# Altium schematic sheet HCPL-3120 DIP Gate Driver Circuit.SchDoc
size A0; SheetNumber: 1; SheetTotal: 1; SPICEModelCacheYLEDQIFW: <root> / <DocumentId>YLEDQIFW</DocumentId> / </root>
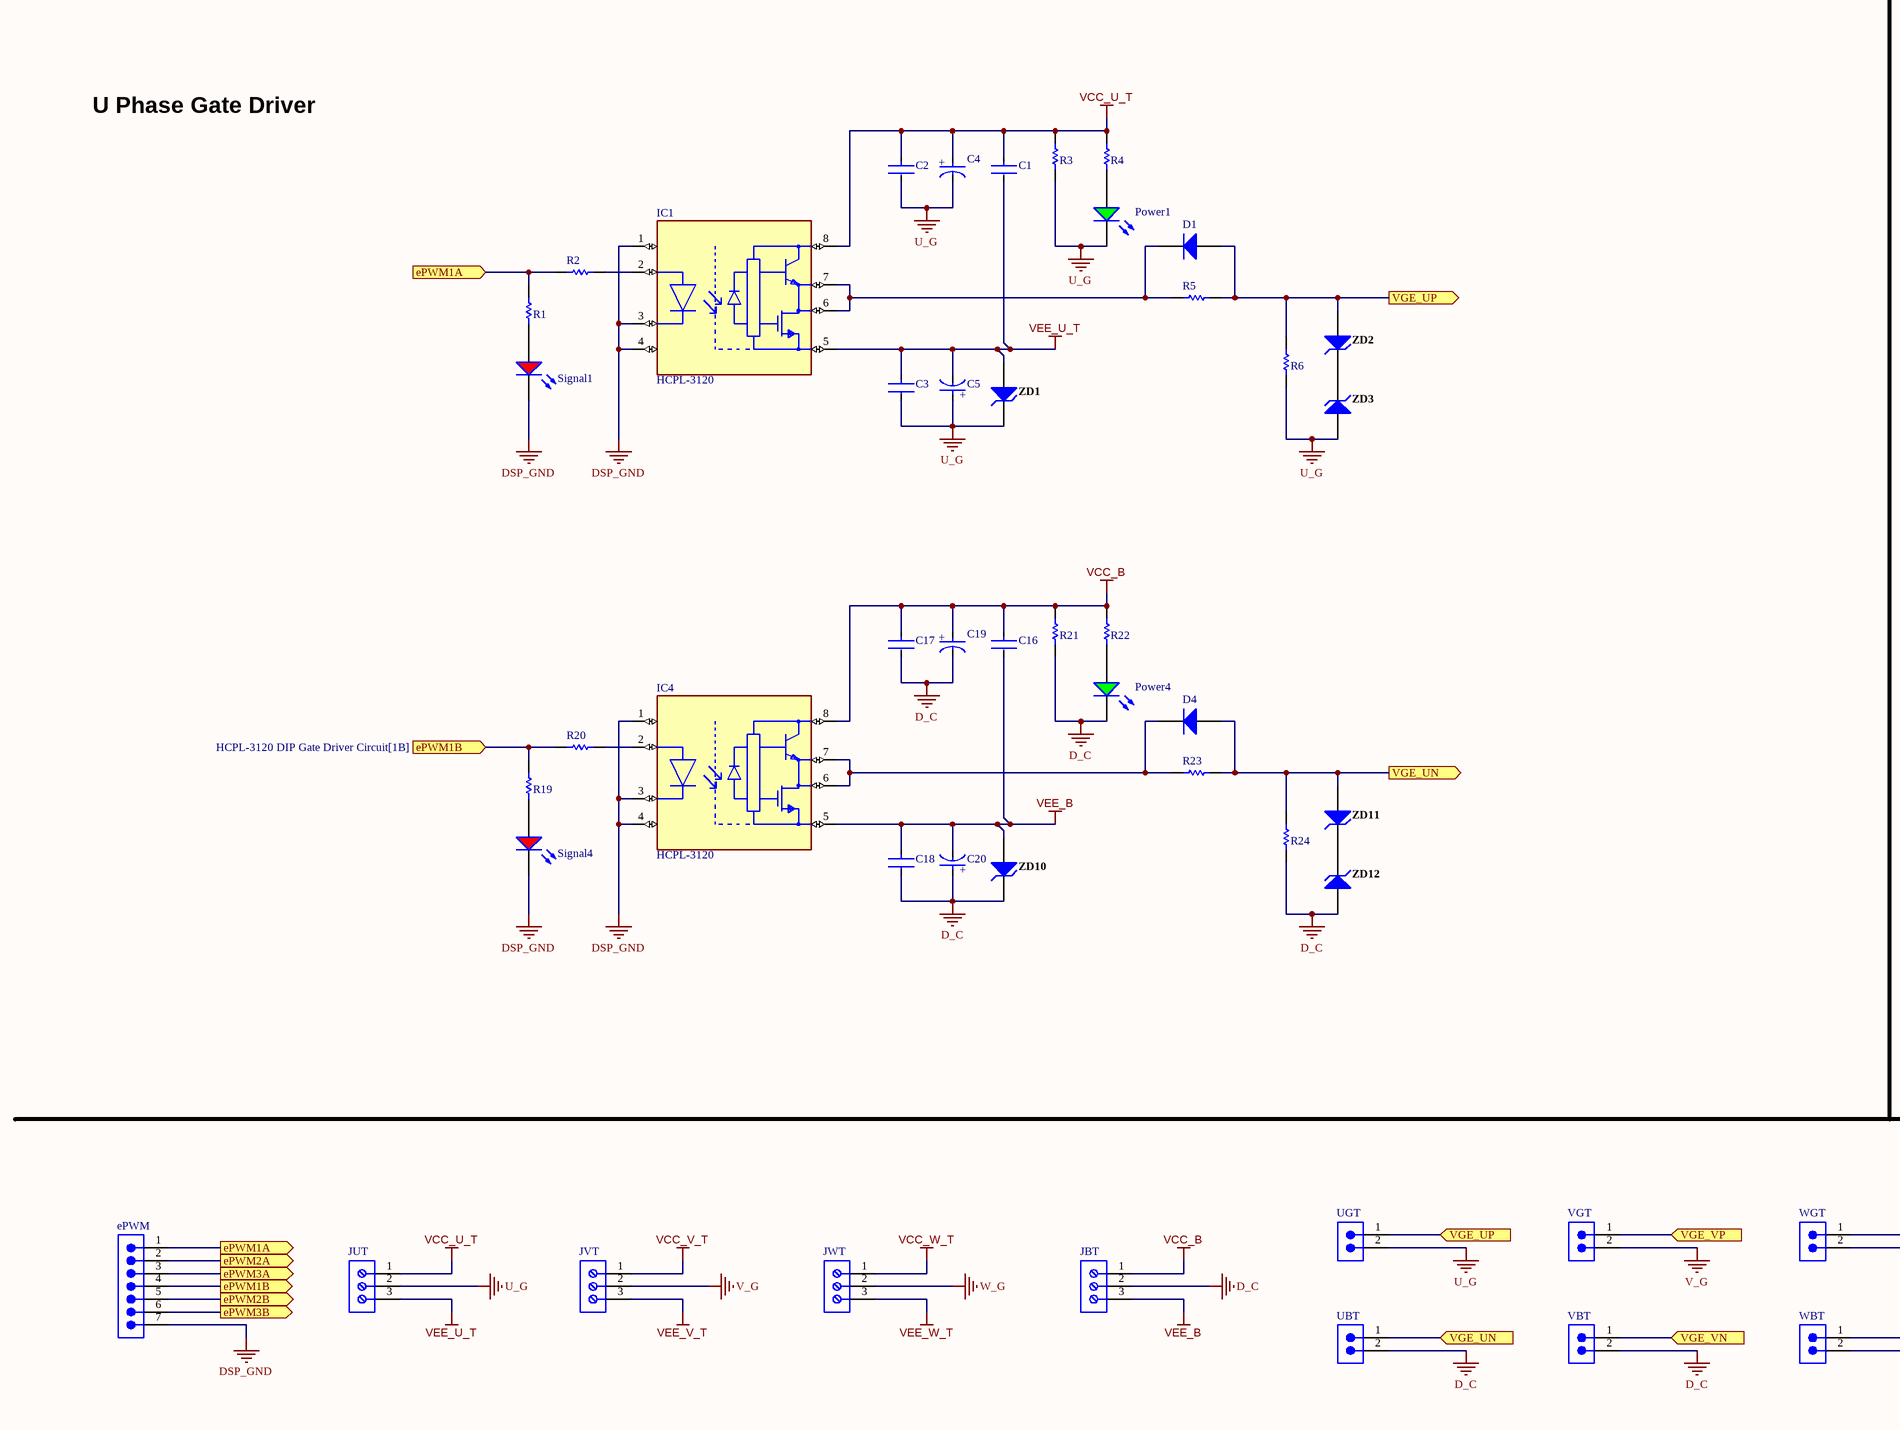
[diagram p0: HCPL-3120 DIP Gate Driver Circuit.SchDoc, left]
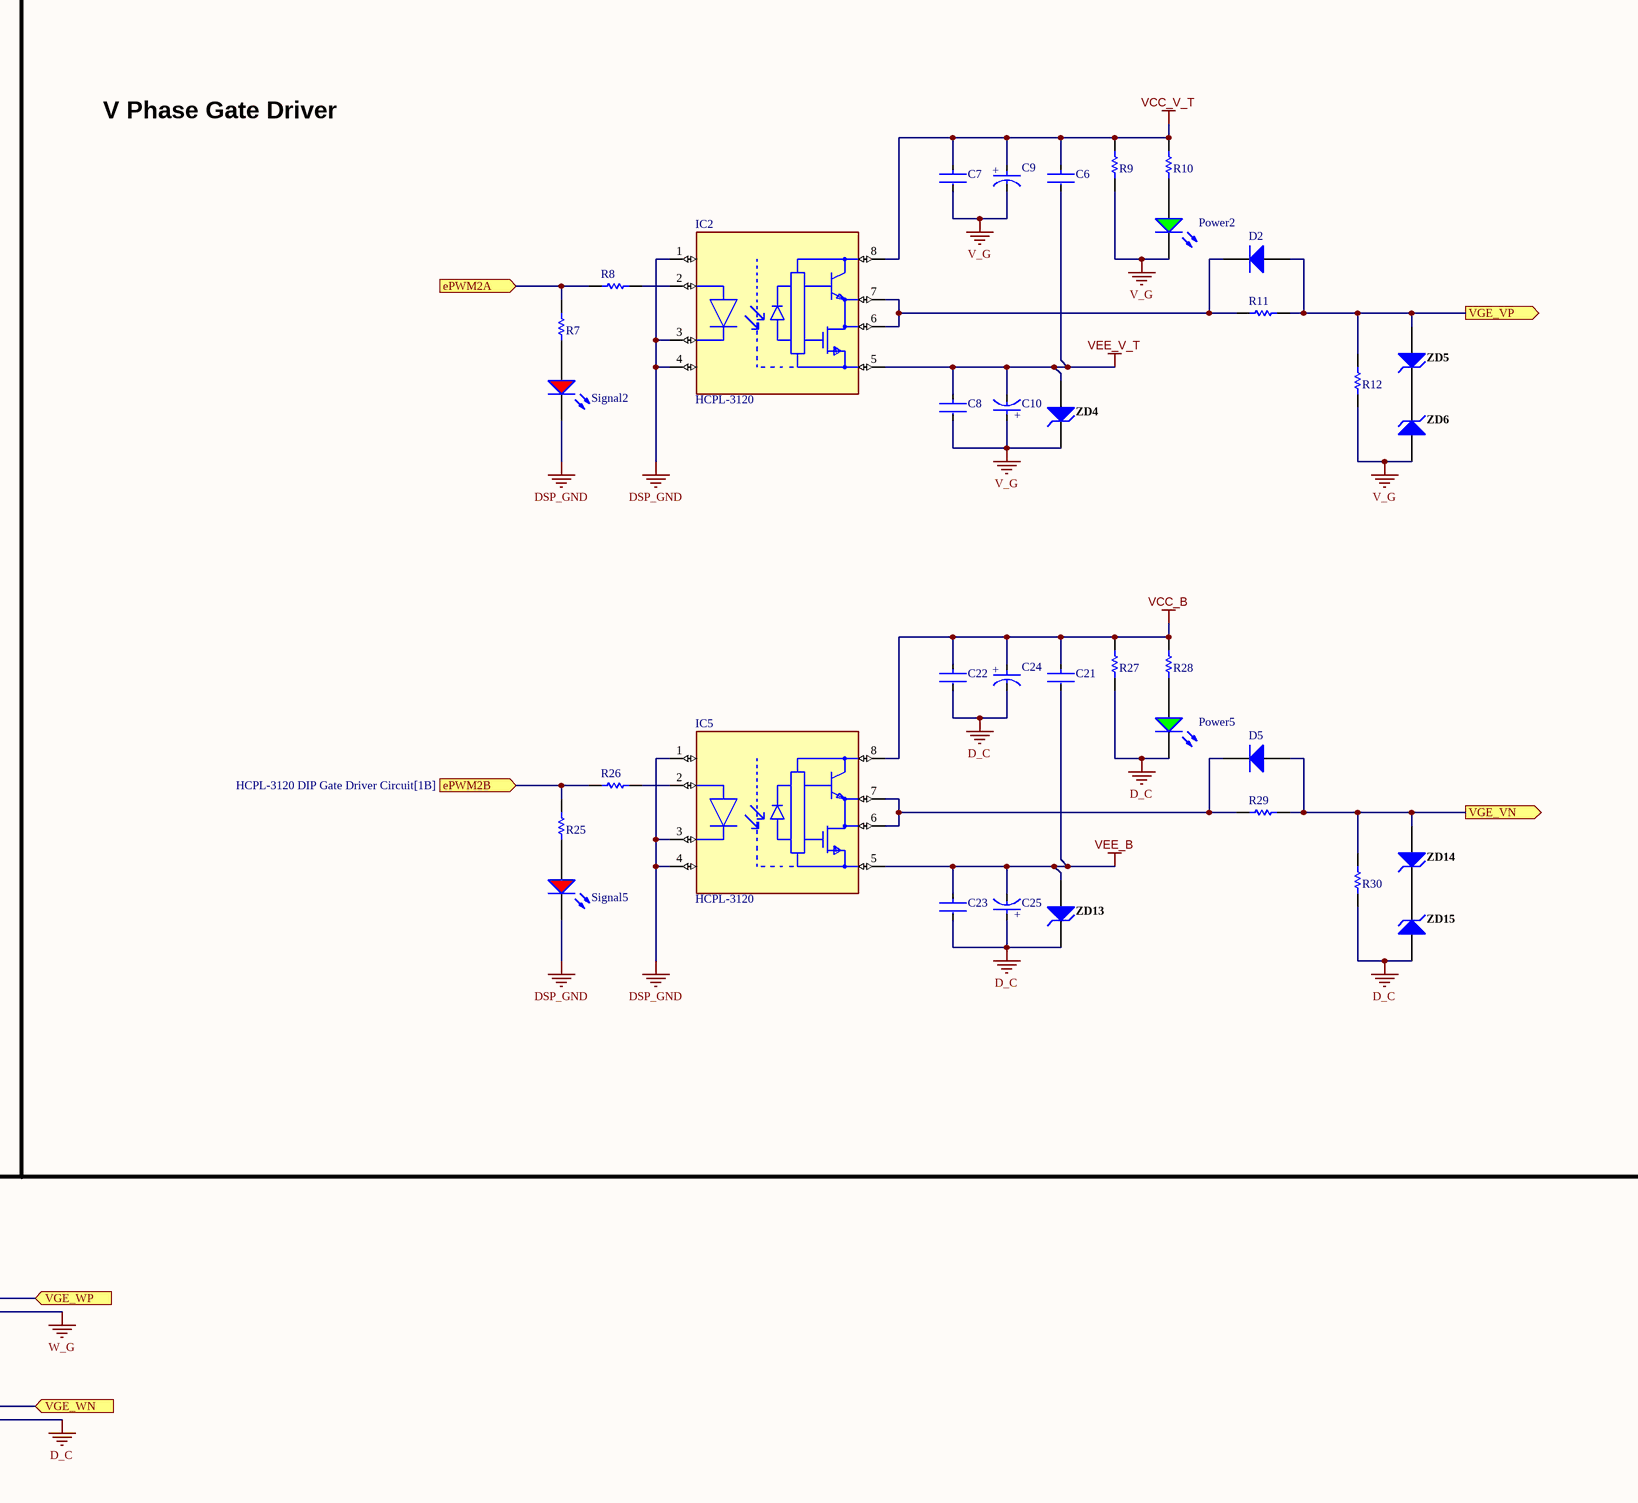
[diagram p1: HCPL-3120 DIP Gate Driver Circuit.SchDoc, middle]
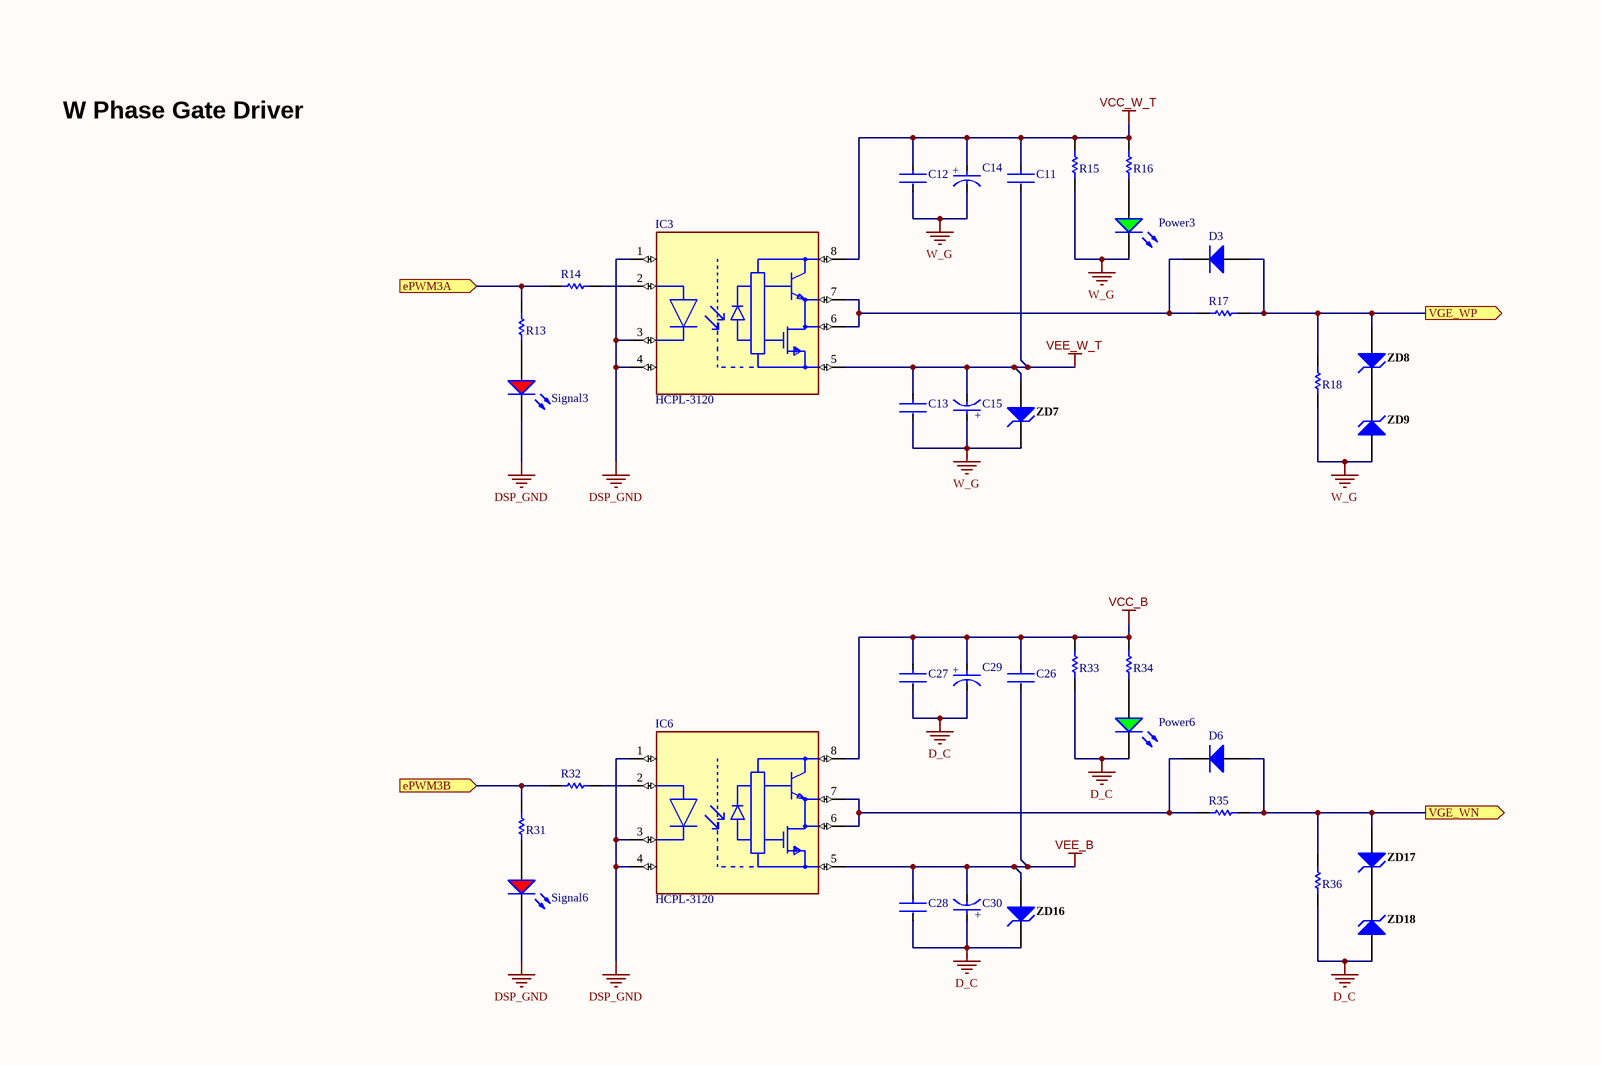
[diagram p2: HCPL-3120 DIP Gate Driver Circuit.SchDoc, right]

## Parts
C1  SR205C104KAR  [FP-SR20-MFG]  (value not drawn)
C2  SR205C104KAR  [FP-SR20-MFG]  (value not drawn)
C3  SR205C104KAR  [FP-SR20-MFG]  (value not drawn)
C4  EEUTA1H101  [FP-RAD-TH-D_10_0_5-L_12_5-MFG]  (value not drawn)
C5  EEUTA1H101  [FP-RAD-TH-D_10_0_5-L_12_5-MFG]  (value not drawn)
C6  SR205C104KAR  [FP-SR20-MFG]  (value not drawn)
C7  SR205C104KAR  [FP-SR20-MFG]  (value not drawn)
C8  SR205C104KAR  [FP-SR20-MFG]  (value not drawn)
C9  EEUTA1H101  [FP-RAD-TH-D_10_0_5-L_12_5-MFG]  (value not drawn)
C10  EEUTA1H101  [FP-RAD-TH-D_10_0_5-L_12_5-MFG]  (value not drawn)
C11  SR205C104KAR  [FP-SR20-MFG]  (value not drawn)
C12  SR205C104KAR  [FP-SR20-MFG]  (value not drawn)
C13  SR205C104KAR  [FP-SR20-MFG]  (value not drawn)
C14  EEUTA1H101  [FP-RAD-TH-D_10_0_5-L_12_5-MFG]  (value not drawn)
C15  EEUTA1H101  [FP-RAD-TH-D_10_0_5-L_12_5-MFG]  (value not drawn)
C16  SR205C104KAR  [FP-SR20-MFG]  (value not drawn)
C17  SR205C104KAR  [FP-SR20-MFG]  (value not drawn)
C18  SR205C104KAR  [FP-SR20-MFG]  (value not drawn)
C19  EEUTA1H101  [FP-RAD-TH-D_10_0_5-L_12_5-MFG]  (value not drawn)
C20  EEUTA1H101  [FP-RAD-TH-D_10_0_5-L_12_5-MFG]  (value not drawn)
C21  SR205C104KAR  [FP-SR20-MFG]  (value not drawn)
C22  SR205C104KAR  [FP-SR20-MFG]  (value not drawn)
C23  SR205C104KAR  [FP-SR20-MFG]  (value not drawn)
C24  EEUTA1H101  [FP-RAD-TH-D_10_0_5-L_12_5-MFG]  (value not drawn)
C25  EEUTA1H101  [FP-RAD-TH-D_10_0_5-L_12_5-MFG]  (value not drawn)
C26  SR205C104KAR  [FP-SR20-MFG]  (value not drawn)
C27  SR205C104KAR  [FP-SR20-MFG]  (value not drawn)
C28  SR205C104KAR  [FP-SR20-MFG]  (value not drawn)
C29  EEUTA1H101  [FP-RAD-TH-D_10_0_5-L_12_5-MFG]  (value not drawn)
C30  EEUTA1H101  [FP-RAD-TH-D_10_0_5-L_12_5-MFG]  (value not drawn)
D1  1N4007-B  [DIOD-DO-41-P-2_V]  (value not drawn)
D2  1N4007-B  [DIOD-DO-41-P-2_V]  (value not drawn)
D3  1N4007-B  [DIOD-DO-41-P-2_V]  (value not drawn)
D4  1N4007-B  [DIOD-DO-41-P-2_V]  (value not drawn)
D5  1N4007-B  [DIOD-DO-41-P-2_V]  (value not drawn)
D6  1N4007-B  [DIOD-DO-41-P-2_V]  (value not drawn)
ePWM  61300711121  [61300711121]  (value not drawn)
IC1  HCPL-3120  [PCBComponent_1]
IC2  HCPL-3120  [PCBComponent_1]
IC3  HCPL-3120  [PCBComponent_1]
IC4  HCPL-3120  [PCBComponent_1]
IC5  HCPL-3120  [PCBComponent_1]
IC6  HCPL-3120  [PCBComponent_1]
JBT  691214110003  [691214110003]  (value not drawn)
JUT  691214110003  [691214110003]  (value not drawn)
JVT  691214110003  [691214110003]  (value not drawn)
JWT  691214110003  [691214110003]  (value not drawn)
Power1  151031VS04000  [WL-TMRC_D3.95H5.3]  (value not drawn)
Power2  151031VS04000  [WL-TMRC_D3.95H5.3]  (value not drawn)
Power3  151031VS04000  [WL-TMRC_D3.95H5.3]  (value not drawn)
Power4  151031VS04000  [WL-TMRC_D3.95H5.3]  (value not drawn)
Power5  151031VS04000  [WL-TMRC_D3.95H5.3]  (value not drawn)
Power6  151031VS04000  [WL-TMRC_D3.95H5.3]  (value not drawn)
R1  MFR-25FBF52-1K  [RESA60-630X240]  (value not drawn)
R2  MFR-25FBF52-221R  [RESA60-630X240]  (value not drawn)
R3  MFR-25FBF52-1K  [RESA60-630X240]  (value not drawn)
R4  MFR-25FBF52-1K  [RESA60-630X240]  (value not drawn)
R5  MFR-25FBF52-47R5  [RESA60-630X240]  (value not drawn)
R6  MFR-25FBF5210K  [RESA60-630X240]  (value not drawn)
R7  MFR-25FBF52-1K  [RESA60-630X240]  (value not drawn)
R8  MFR-25FBF52-221R  [RESA60-630X240]  (value not drawn)
R9  MFR-25FBF52-1K  [RESA60-630X240]  (value not drawn)
R10  MFR-25FBF52-1K  [RESA60-630X240]  (value not drawn)
R11  MFR-25FBF52-47R5  [RESA60-630X240]  (value not drawn)
R12  MFR-25FBF5210K  [RESA60-630X240]  (value not drawn)
R13  MFR-25FBF52-1K  [RESA60-630X240]  (value not drawn)
R14  MFR-25FBF52-221R  [RESA60-630X240]  (value not drawn)
R15  MFR-25FBF52-1K  [RESA60-630X240]  (value not drawn)
R16  MFR-25FBF52-1K  [RESA60-630X240]  (value not drawn)
R17  MFR-25FBF52-47R5  [RESA60-630X240]  (value not drawn)
R18  MFR-25FBF5210K  [RESA60-630X240]  (value not drawn)
R19  MFR-25FBF52-1K  [RESA60-630X240]  (value not drawn)
R20  MFR-25FBF52-221R  [RESA60-630X240]  (value not drawn)
R21  MFR-25FBF52-1K  [RESA60-630X240]  (value not drawn)
R22  MFR-25FBF52-1K  [RESA60-630X240]  (value not drawn)
R23  MFR-25FBF52-47R5  [RESA60-630X240]  (value not drawn)
R24  MFR-25FBF5210K  [RESA60-630X240]  (value not drawn)
R25  MFR-25FBF52-1K  [RESA60-630X240]  (value not drawn)
R26  MFR-25FBF52-221R  [RESA60-630X240]  (value not drawn)
R27  MFR-25FBF52-1K  [RESA60-630X240]  (value not drawn)
R28  MFR-25FBF52-1K  [RESA60-630X240]  (value not drawn)
R29  MFR-25FBF52-47R5  [RESA60-630X240]  (value not drawn)
R30  MFR-25FBF5210K  [RESA60-630X240]  (value not drawn)
R31  MFR-25FBF52-1K  [RESA60-630X240]  (value not drawn)
R32  MFR-25FBF52-221R  [RESA60-630X240]  (value not drawn)
R33  MFR-25FBF52-1K  [RESA60-630X240]  (value not drawn)
R34  MFR-25FBF52-1K  [RESA60-630X240]  (value not drawn)
R35  MFR-25FBF52-47R5  [RESA60-630X240]  (value not drawn)
R36  MFR-25FBF5210K  [RESA60-630X240]  (value not drawn)
Signal1  151031SS04000  [WL-TMRC_D3.95H5.3]  (value not drawn)
Signal2  151031SS04000  [WL-TMRC_D3.95H5.3]  (value not drawn)
Signal3  151031SS04000  [WL-TMRC_D3.95H5.3]  (value not drawn)
Signal4  151031SS04000  [WL-TMRC_D3.95H5.3]  (value not drawn)
Signal5  151031SS04000  [WL-TMRC_D3.95H5.3]  (value not drawn)
Signal6  151031SS04000  [WL-TMRC_D3.95H5.3]  (value not drawn)
UBT  61300211121  [61300211121]  (value not drawn)
UGT  61300211121  [61300211121]  (value not drawn)
VBT  61300211121  [61300211121]  (value not drawn)
VGT  61300211121  [61300211121]  (value not drawn)
WBT  61300211121  [61300211121]  (value not drawn)
WGT  61300211121  [61300211121]  (value not drawn)
ZD1  1N4749A  [FAIR-DO-41-2_V]  (value not drawn)
ZD2  1N4749A  [FAIR-DO-41-2_V]  (value not drawn)
ZD3  1N4749A  [FAIR-DO-41-2_V]  (value not drawn)
ZD4  1N4749A  [FAIR-DO-41-2_V]  (value not drawn)
ZD5  1N4749A  [FAIR-DO-41-2_V]  (value not drawn)
ZD6  6  [FAIR-DO-41-2_V]  (value not drawn)
ZD7  1N4749A  [FAIR-DO-41-2_V]  (value not drawn)
ZD8  1N4749A  [FAIR-DO-41-2_V]  (value not drawn)
ZD9  1N4749A  [FAIR-DO-41-2_V]  (value not drawn)
ZD10  1N4749A  [FAIR-DO-41-2_V]  (value not drawn)
ZD11  1N4749A  [FAIR-DO-41-2_V]  (value not drawn)
ZD12  1N4749A  [FAIR-DO-41-2_V]  (value not drawn)
ZD13  1N4749A  [FAIR-DO-41-2_V]  (value not drawn)
ZD14  1N4749A  [FAIR-DO-41-2_V]  (value not drawn)
ZD15  1N4749A  [FAIR-DO-41-2_V]  (value not drawn)
ZD16  1N4749A  [FAIR-DO-41-2_V]  (value not drawn)
ZD17  1N4749A  [FAIR-DO-41-2_V]  (value not drawn)
ZD18  1N4749A  [FAIR-DO-41-2_V]  (value not drawn)

## Ports
ePWM1A (in, see HCPL-3120 DIP Gate Driver Circuit[1B]), ePWM1A (out, see HCPL-3120 DIP Gate Driver Circuit[2A]), ePWM1B (in, see HCPL-3120 DIP Gate Driver Circuit[1B]), ePWM1B (out, see HCPL-3120 DIP Gate Driver Circuit[2A]), ePWM2A (in, see HCPL-3120 DIP Gate Driver Circuit[1B]), ePWM2A (out, see HCPL-3120 DIP Gate Driver Circuit[7A]), ePWM2B (in, see HCPL-3120 DIP Gate Driver Circuit[1B]), ePWM2B (out, see HCPL-3120 DIP Gate Driver Circuit[7A]), ePWM3A (in, see HCPL-3120 DIP Gate Driver Circuit[1B]), ePWM3A (out, see HCPL-3120 DIP Gate Driver Circuit[12A]), ePWM3B (in, see HCPL-3120 DIP Gate Driver Circuit[1B]), ePWM3B (out, see HCPL-3120 DIP Gate Driver Circuit[12A]), VGE_UN (in, see HCPL-3120 DIP Gate Driver Circuit[4A]), VGE_UN (out, see HCPL-3120 DIP Gate Driver Circuit[5B]), VGE_UP (in, see HCPL-3120 DIP Gate Driver Circuit[4A]), VGE_UP (out, see HCPL-3120 DIP Gate Driver Circuit[5B]), VGE_VN (in, see HCPL-3120 DIP Gate Driver Circuit[10A]), VGE_VN (out, see HCPL-3120 DIP Gate Driver Circuit[5B]), VGE_VP (in, see HCPL-3120 DIP Gate Driver Circuit[10A]), VGE_VP (out, see HCPL-3120 DIP Gate Driver Circuit[5B]), VGE_WN (in, see HCPL-3120 DIP Gate Driver Circuit[15A]), VGE_WN (out, see HCPL-3120 DIP Gate Driver Circuit[6B]), VGE_WP (in, see HCPL-3120 DIP Gate Driver Circuit[15A]), VGE_WP (out, see HCPL-3120 DIP Gate Driver Circuit[6B])

## Nets
D_C: C17.2 C18.2 C19.1(C) C20.2(A) C22.2 C23.2 C24.1(C) C25.2(A) C27.2 C28.2 C29.1(C) C30.2(A) JBT.2 Power4.2(K) Power5.2(K) Power6.2(K) R21.2 R24.2 R27.2 R30.2 R33.2 R36.2 UBT.2 VBT.2 WBT.2 ZD10.2(K) ZD12.1(A) ZD13.2(K) ZD15.1(A) ZD16.2(K) ZD18.1(A)
DSP_GND: ePWM.7 IC1.1(NC) IC1.3(K) IC1.4(NC) IC2.1(NC) IC2.3(K) IC2.4(NC) IC3.1(NC) IC3.3(K) IC3.4(NC) IC4.1(NC) IC4.3(K) IC4.4(NC) IC5.1(NC) IC5.3(K) IC5.4(NC) IC6.1(NC) IC6.3(K) IC6.4(NC) Signal1.2(K) Signal2.2(K) Signal3.2(K) Signal4.2(K) Signal5.2(K) Signal6.2(K)
U_G: C2.2 C3.2 C4.1(C) C5.2(A) JUT.2 Power1.2(K) R3.2 R6.2 UGT.2 ZD1.2(K) ZD3.1(A)
V_G: C7.2 C8.2 C9.1(C) C10.2(A) JVT.2 Power2.2(K) R9.2 R12.2 VGT.2 ZD4.2(K) ZD6.1(A)
VCC_B: C16.1 C17.1 C19.2(A) C21.1 C22.1 C24.2(A) C26.1 C27.1 C29.2(A) IC4.8(VCC) IC5.8(VCC) IC6.8(VCC) JBT.1 R21.1 R22.1 R27.1 R28.1 R33.1 R34.1
VCC_U_T: C1.1 C2.1 C4.2(A) IC1.8(VCC) JUT.1 R3.1 R4.1
VCC_V_T: C6.1 C7.1 C9.2(A) IC2.8(VCC) JVT.1 R9.1 R10.1
VCC_W_T: C11.1 C12.1 C14.2(A) IC3.8(VCC) JWT.1 R15.1 R16.1
VEE_B: C16.2 C18.1 C20.1(C) C21.2 C23.1 C25.1(C) C26.2 C28.1 C30.1(C) IC4.5(VEE) IC5.5(VEE) IC6.5(VEE) JBT.3 ZD10.1(A) ZD13.1(A) ZD16.1(A)
VEE_U_T: C1.2 C3.1 C5.1(C) IC1.5(VEE) JUT.3 ZD1.1(A)
VEE_V_T: C6.2 C8.1 C10.1(C) IC2.5(VEE) JVT.3 ZD4.1(A)
VEE_W_T: C11.2 C13.1 C15.1(C) IC3.5(VEE) JWT.3 ZD7.1(A)
W_G: C12.2 C13.2 C14.1(C) C15.2(A) JWT.2 Power3.2(K) R15.2 R18.2 WGT.2 ZD7.2(K) ZD9.1(A)
ePWM1A: ePWM.1 R1.1 R2.1 ; port ePWM1A
ePWM1B: ePWM.4 R19.1 R20.1 ; port ePWM1B
ePWM2A: ePWM.2 R7.1 R8.1 ; port ePWM2A
ePWM2B: ePWM.5 R25.1 R26.1 ; port ePWM2B
ePWM3A: ePWM.3 R13.1 R14.1 ; port ePWM3A
ePWM3B: ePWM.6 R31.1 R32.1 ; port ePWM3B
VGE_UN: D4.1(A) R23.2 R24.1 UBT.1 ZD11.1(A) ; port VGE_UN
VGE_UP: D1.1(A) R5.2 R6.1 UGT.1 ZD2.1(A) ; port VGE_UP
VGE_VN: D5.1(A) R29.2 R30.1 VBT.1 ZD14.1(A) ; port VGE_VN
VGE_VP: D2.1(A) R11.2 R12.1 VGT.1 ZD5.1(A) ; port VGE_VP
VGE_WN: D6.1(A) R35.2 R36.1 WBT.1 ZD17.1(A) ; port VGE_WN
VGE_WP: D3.1(A) R17.2 R18.1 WGT.1 ZD8.1(A) ; port VGE_WP
NetD1_2: D1.2(K) IC1.6(VO) IC1.7(VO) R5.1
NetD2_2: D2.2(K) IC2.6(VO) IC2.7(VO) R11.1
NetD3_2: D3.2(K) IC3.6(VO) IC3.7(VO) R17.1
NetD4_2: D4.2(K) IC4.6(VO) IC4.7(VO) R23.1
NetD5_2: D5.2(K) IC5.6(VO) IC5.7(VO) R29.1
NetD6_2: D6.2(K) IC6.6(VO) IC6.7(VO) R35.1
NetIC1_2: IC1.2(A) R2.2
NetIC2_2: IC2.2(A) R8.2
NetIC3_2: IC3.2(A) R14.2
NetIC4_2: IC4.2(A) R20.2
NetIC5_2: IC5.2(A) R26.2
NetIC6_2: IC6.2(A) R32.2
NetPower1_1: Power1.1(A) R4.2
NetPower2_1: Power2.1(A) R10.2
NetPower3_1: Power3.1(A) R16.2
NetPower4_1: Power4.1(A) R22.2
NetPower5_1: Power5.1(A) R28.2
NetPower6_1: Power6.1(A) R34.2
NetR1_2: R1.2 Signal1.1(A)
NetR7_2: R7.2 Signal2.1(A)
NetR13_2: R13.2 Signal3.1(A)
NetR19_2: R19.2 Signal4.1(A)
NetR25_2: R25.2 Signal5.1(A)
NetR31_2: R31.2 Signal6.1(A)
NetZD2_2: ZD2.2(K) ZD3.2(K)
NetZD5_2: ZD5.2(K) ZD6.2(K)
NetZD8_2: ZD8.2(K) ZD9.2(K)
NetZD11_2: ZD11.2(K) ZD12.2(K)
NetZD14_2: ZD14.2(K) ZD15.2(K)
NetZD17_2: ZD17.2(K) ZD18.2(K)

## Notes on the sheet
- U Phase Gate Driver
- V Phase Gate Driver
- W Phase Gate Driver
- (in symbol CMP-05427-000114-1) +

## Library data of the parts
C1-C3 C6-C8 C11-C13 C16-C18 C21-C23 C26-C28 = CMP-04427-000013-1: CAP CER 0.1UF 50V X7R RADIAL; Manufacturer: AVX; Material: Ceramic; Tolerance: 10%; Capacitance: 100nF; Value: 100nF; Voltage: 50V; Height: 5.08mm; Digikey Description: CAP CER 0.1UF 50V X7R RADIAL; Device Class L2: Capacitors; ComponentLink2URL: http://datasheets.avx.com/SR-Series.pdf; Temperature Range High: +125°C; Lead Free: Yes; Manufacturer Part Number: SR205C104KAR; Category: Cap; Device Class L1: Passive Components; Temperature: -55°C to +125°C; Voltage Rating: 50V; ComponentLink2Description: Datasheet; RoHS: TRUE; Automotive: No; Octopart: https://octopart.com/sr205c104kar-avx-145048; Mouser Description: Multilayer Ceramic Capacitors MLCC - Leaded 50volts 0.1uF 10% X7R; Temperature Characteristic: X7R; Device Class L3: Ceramic Capacitors; Temperature Range Low: -55°C; Package: SR20
C4 C5 C9 C10 C14 C15 C19 C20 C24 C25 C29 C30 = CMP-05427-000114-1: Aluminum Electrolytic Capacitors (Radial Lead Type) AEC-Q200 Qualified 100uF ±20% 50V; ESR (Equivalent Series Resistance): 180mR; Lead Diameter: 0.6mm; Life (Hours): 2000Hour; Ripple Current: 555mA; Series: TA; Package Quantity: 200; Length: 12.5mm; Lead Pitch: 5mm; REACH SVHC: No SVHC; RoHS Compliant: Yes; Height: 12.5mm; Contact Plating: Tin; Capacitance: 100uF; Height - Seated (Max): 0.531inch; Min Operating Temperature: -40°C; Voltage Rating (DC): 50V; Voltage Rating: 50V; Case/Package: Radial; Radiation Hardening: No; Tolerance: 20%; Impedance: 180mR; Diameter: 10mm; Packaging: Bulk; Max Operating Temperature: 125°C; Termination: Radial; Mount: Through Hole
D1-D6 = CMP-0639-00010-2: 30V, 1A Rectifier, 8 pF, -65 to 150 degC, 2-Pin DO-41 Plastic, RoHS, Bulk; Manufacturer: Diodes Inc; CT (pF): 8; VRRM (V): 1000; Max. Average Rectified Current IO (A): 1; Max. IR (uA): 5; Max. IFSM (A): 30; Packing: Bulk; Mounting Technology: Through Hole; PackageDescription: 2-Pin Axial Lead, Body 4.635 x 2.36 mm, Lead Spread 25.4 mm; Operating Temperature Range (degC): -65 to 150; ComponentLink1Description: Manufacturer URL; DatasheetVersion: Rev. 8-2; ComponentLink1URL: http://diodes.com/; ComponentLink2Description: Datasheet; PartNumber: 1N4007-B; ComponentLink2URL: http://diodes.com/datasheets/ds28002.pdf; RoHS: TRUE; PackageReference: DO-41-P-2; VF (V): 1
ePWM = CMP-1502-01074-2: NexarPartId: 32855531; Pitch: 2.54mm; Connector Type: Male Pin; Gender: Male; Current Rating: 3A; Contact Resistance: 20mΩ; Operating Supply Voltage: 250V; Number of Contacts: 7; REACH SVHC: Unknown; Termination: Solder; Contact Plating: Gold; Lead Pitch: 2.54mm; Contact Mating Length: 5.9944mm; RoHS: Compliant; Packaging: Bulk; Mount: Through Hole; Color: Black; Number of Pins: 7; Contact Material: Copper; Number of Rows: 1; Orientation: Vertical; Number of Positions: 7
IC1-IC6 = CMP-18400-000012-1: OPTOISO 3.75KV 1CH GATE DVR 8DIP
JBT JUT JVT JWT = CMP-1502-02466-2: NexarPartId: 18818289; Number of Levels: 1; Voltage: 300V; Pitch: 3.5052mm; Stripping Length: -6mm; Number of Positions Per Level: 3; Plating: Brass, Steel; Wire/Cable Gauge: 24AWG; Wire Gauge (Min): 16AWG; Current Rating: 10A; Width: 10.9mm; Length: 7.4mm; Housing Material: Nylon; Height: 12.2mm; Min Operating Temperature: -40°C; Contact Plating: Brass, Tin; Packaging: Box; Color: Blue, Green; Number of Contacts: 3; Number of Pins: 3; Voltage Rating: 300V; Termination: Screw; Lead Pitch: 3.5mm; Max Operating Temperature: 105°C; Mount: Through Hole; Contact Material: Brass; RoHS: Compliant; Wire Gauge (Max): 24AWG; Current: 10A; REACH SVHC: Unknown
Power1-Power6 = CMP-1488-00001-2: Led, Green, T-1 (3Mm), 570 Nm, 2.1 V, 30 Ma, 120 Mcd; NexarPartId: 29717804; Test Current: 20mA; Peak Wavelength: 573nm; Max Reverse Voltage (DC): 5V; Forward Voltage: 2.1V; Forward Current: 100mA; Dominant Wavelength: 570nm; Lens Style: Circular, Diffused, Round; Viewing Angle: 40°; Luminous Intensity: 120mcd; REACH SVHC: Unknown; Lens Size: 3mm; Mount: Through Hole; Width: 3mm; Color: Green; Case/Package: Radial; Packaging: Bulk; Height: 5.3mm; Wavelength: 570nm; RoHS: Compliant; Max Operating Temperature: 85°C; Length: 3mm; Number of Pins: 2; Min Operating Temperature: -40°C
R1 R3 R4 R7 R9 R10 R13 R15 R16 R19 R21 R22 R25 R27 R28 R31 R33 R34 = CMP-1659-00075-1: Axial Resistor, 1K Ohm, +/- 1%, 0.25W, -55 to 155 degC, 2-Pin THD, RoHS, Bulk; Voltage Rating: 250 V; Resistance: 10 kohm; Power Rating: 250 mW; ComponentLink2Description: Datasheet; RoHSCompliant: true; PackageReference: MFR-25; Case\Package: Axial; Max Operating Temperature: 155 degC; DatasheetVersion: Apr-13; Tolerance: 1%; ComponentLink1URL: http://www.yageo.com/; Length: 0.248 inch; ComponentLink2URL: http://www.yageo.com/documents/recent/Yageo%20LR_MFR_2013.pdf; Packaging: Bulk; Package Quantity: 200; PackageDescription: 2-Pin Axial Lead, Dia 2.4 mm, Body Length 6.3 mm; Min Operating Temperature: -55 degC; ComponentLink1Description: Manufacturer URL
R2 R8 R14 R20 R26 R32 = CMP-1659-00072-1: Axial Resistor, 330 Ohm, +/- 1%, 0.25W, -55 to 155 degC, 2-Pin THD, RoHS, Bulk; Max Supply Voltage: 3.6 V; Min Supply Voltage: 1.95 V; Interface: I2C; Case\Package: QFN; Nominal Supply Voltage: 2.5 V; Bandwidth: 800 Hz; Max Operating Temperature: 85 degC; Height: 0.95 mm; Mount: Surface Mount; Packaging: Tape and Reel; PackageReference: MFR-25; ComponentLink1Description: Manufacturer URL; Length: 3 mm; Min Operating Temperature: -40 degC; RoHSCompliant: true; ComponentLink2Description: Datasheet; Package Quantity: 1000; Pins: 16; ComponentLink2URL: http://www.yageo.com/documents/recent/Yageo%20LR_MFR_2013.pdf; Radiation Hardening: No; ComponentLink1URL: http://www.yageo.com/; Weight: 0.001122 oz; REACH SVHC: No SVHC; DatasheetVersion: Apr-13; PackageDescription: 2-Pin Axial Lead, Dia 2.4 mm, Body Length 6.3 mm
R5 R11 R17 R23 R29 R35 = CMP-1659-00067-1: Axial Resistor, 30 Ohm, +/- 1%, 0.25 W, -55 to 155 degC, 2-Pin THD, RoHS, Bulk; Nominal Voltage Gain: 100 dB; Slew Rate: 1 V\us; Common Mode Rejection Ratio: 50 dB; Bandwidth: 1 MHz; Min Supply Voltage: 3 V; Case\Package: SOIC; Output Current: 160 mA; Channels: 4; Max Supply Voltage: 5 V; Nominal Supply Current: 170 uA; Packaging: Tape and Reel; Pins: 14; ComponentLink1URL: http://www.yageo.com/; RoHSCompliant: true; Radiation Hardening: No; Width: 3.91 mm; ComponentLink2Description: Datasheet; PackageReference: MFR-25; Length: 8.65 mm; ComponentLink1Description: Manufacturer URL; Mount: Surface Mount; Nominal Gain Bandwith Product: 1 MHz; DatasheetVersion: Apr-13; Unity Gain Bandwidth Product: 1 MHz; Min Operating Temperature: -40 degC; Max Operating Temperature: 85 degC; PackageDescription: 2-Pin Axial Lead, Dia 2.4 mm, Body Length 6.3 mm; ComponentLink2URL: http://www.yageo.com/documents/recent/Yageo%20LR_MFR_2013.pdf; Package Quantity: 2500; Height: 1.58 mm; REACH SVHC: No SVHC
R6 R12 R18 R24 R30 R36 = CMP-1659-00074-2: Axial Resistor, 10K Ohm, +/- 1%, 0.25 W, -55 to 155 degC, 2-Pin THD, RoHS, Bulk; Manufacturer: Yageo; Temperature Coefficient: 100ppm\/degreesC; Voltage Rating: 250V; Voltage Rating (DC): 200V; Resistance: 10KOhm; Max Power Dissipation: 250mW; Datasheet URL: http://www.yageo.com/documents/recent/Yageo%20LR_MFR_2013.pdf; Packaging: Bulk; RoHSCompliant: True; Mount: ThroughHole; Package Reference: MFR-25; Termination: Axial; Composition: MetalFilm; Number of Terminations: 2; Package Quantity: 200; Mounting Technology: ThroughHole; Length: 0.248inch; Max Operating Temperature: 155degC; Min Operating Temperature: -55degC; Datasheet Version: 04/2013; Lead Free: LeadFree; Manufacturer URL: http://www.yageo.com/; Tolerance: 1%; Power Rating: 250mW; Package Description: 2-Pin Axial Lead, Dia 2.4 mm, Body Length 6.3 mm; Military Standard: Not; Case\/Package: Axial
Signal1-Signal6 = CMP-1488-00005-2: Led, Red, T-1 (3Mm), 635 Nm, 2 V, 30 Ma, 160 Mcd; NexarPartId: 29717802; Wavelength: 635nm; Luminous Intensity: 160mcd; Peak Wavelength: 640nm; Forward Voltage: 2V; Max Reverse Voltage (DC): 5V; Viewing Angle: 40°; Forward Current: 100mA; Lens Style: Circular, Diffused, Round; Test Current: 20mA; Packaging: Bulk; Lens Size: 3mm; RoHS: Compliant; Height: 5.3mm; Mount: Through Hole; Max Operating Temperature: 85°C; Color: Red; Length: 3mm; Dominant Wavelength: 635nm; REACH SVHC: Unknown; Case/Package: Radial; Min Operating Temperature: -40°C; Width: 3mm
UBT UGT VBT VGT WBT WGT = CMP-1712-00002-5: NexarPartId: 20081794; Operating Supply Voltage: 250V; Current Rating: 3A; Gender: Male; Number of Contacts: 2; Pitch: 2.54mm; Connector Type: Male Pin; Contact Resistance: 20mΩ; Contact Plating: Gold; Contact Material: Copper; Number of Pins: 2; Min Operating Temperature: -40°C; Packaging: Bulk; Lead Pitch: 2.54mm; Mount: Through Hole; Orientation: Vertical; RoHS: Compliant; REACH SVHC: No SVHC; Height: 8.94mm; Termination: Through Hole; Number of Positions: 2; Contact Mating Length: 5.9944mm; Color: Black; Contact Gender: Male; Number of Rows: 1; Housing Material: PBT; Lead Free: Lead Free; Voltage Rating: 250V; Max Operating Temperature: 125°C
ZD1 ZD4 ZD7 ZD10 ZD13 ZD16 = CMP-0892-00026-1: Zener Diode, 4.7V, 500mW, 5%, -65 to 200 degC, 2-Pin DO-41, Body 2.72 x 5.2 mm, RoHS; Manufacturer: Fairchild Semiconductor; VZ (Max.) (V): 25.2; IR (uA): 5; PD (W): 1; Test Current IZ (mA): 10.5; VZ (Min.) (V): 22.8; ZZ (Max) (ohm): 25; RoHS: TRUE; ComponentLink2Description: Datasheet; ComponentLink3Description: Package Specification; PackageDescription: 2-Pin Axial leaded, Body 2.72 x 5.2 mm, Lead Spread 25.4 mm; Tolerance: 5%; PartNumber: 1N4749A; Operating and Storage Temperature Range: -65 to 200 degC; PackageReference: DO-41-2; PackageVersion: Rev. 2; Mounting Technology: Through Hole; DatasheetVersion: Rev. H3; ComponentLink3URL: http://www.fairchildsemi.com/dwg/DO/DO41A.pdf; ComponentLink1URL: http://www.fairchildsemi.com/; ComponentLink1Description: Manufacturer URL; ComponentLink2URL: http://www.fairchildsemi.com/ds/1N/1N4744A.pdf
ZD2 ZD3 ZD5 ZD8 ZD9 ZD11 ZD12 ZD14 ZD15 ZD17 ZD18 = CMP-0892-00026-1: Zener Diode, 15V, 500mW, 5%, -65 to 200 degC, 2-Pin DO-41, Body 2.72 x 5.2 mm, RoHS; Manufacturer: Fairchild Semiconductor; VZ (Max.) (V): 25.2; IR (uA): 5; PD (W): 1; Test Current IZ (mA): 10.5; VZ (Min.) (V): 22.8; ZZ (Max) (ohm): 25; RoHS: TRUE; ComponentLink2Description: Datasheet; ComponentLink3Description: Package Specification; PackageDescription: 2-Pin Axial leaded, Body 2.72 x 5.2 mm, Lead Spread 25.4 mm; Tolerance: 5%; PartNumber: 1N4749A; Operating and Storage Temperature Range: -65 to 200 degC; PackageReference: DO-41-2; PackageVersion: Rev. 2; Mounting Technology: Through Hole; DatasheetVersion: Rev. H3; ComponentLink3URL: http://www.fairchildsemi.com/dwg/DO/DO41A.pdf; ComponentLink1URL: http://www.fairchildsemi.com/; ComponentLink1Description: Manufacturer URL; ComponentLink2URL: http://www.fairchildsemi.com/ds/1N/1N4744A.pdf
ZD6 = CMP-0892-00026-1: Zener Diode, 15V, 500mW, 5%, -65 to 200 degC, 2-Pin DO-41, Body 2.72 x 5.2 mm, RoHS; Manufacturer: Fairchild Semiconductor; PartNumber: 1N4749A; VZ (Max.) (V): 25.2; IR (uA): 5; PD (W): 1; Test Current IZ (mA): 10.5; VZ (Min.) (V): 22.8; ZZ (Max) (ohm): 25; RoHS: TRUE; ComponentLink2Description: Datasheet; ComponentLink3Description: Package Specification; PackageDescription: 2-Pin Axial leaded, Body 2.72 x 5.2 mm, Lead Spread 25.4 mm; Tolerance: 5%; Operating and Storage Temperature Range: -65 to 200 degC; PackageReference: DO-41-2; PackageVersion: Rev. 2; Mounting Technology: Through Hole; DatasheetVersion: Rev. H3; ComponentLink3URL: http://www.fairchildsemi.com/dwg/DO/DO41A.pdf; ComponentLink1URL: http://www.fairchildsemi.com/; ComponentLink1Description: Manufacturer URL; ComponentLink2URL: http://www.fairchildsemi.com/ds/1N/1N4744A.pdf